# Altium schematic sheet Scan card MCU&Power.SchDoc: MCU & Power
size A3; DrawnBy: G Ivanov; Revision: 00; SheetNumber: 1; SheetTotal: 2; ProjectTitle: SCAN2000-20 STM32 Card; Variant: [No variants]; SheetSize: A3; SPICEModelCacheGEYJKKNZ: <root> / <DocumentId>GEYJKKNZ</DocumentId> / </root>
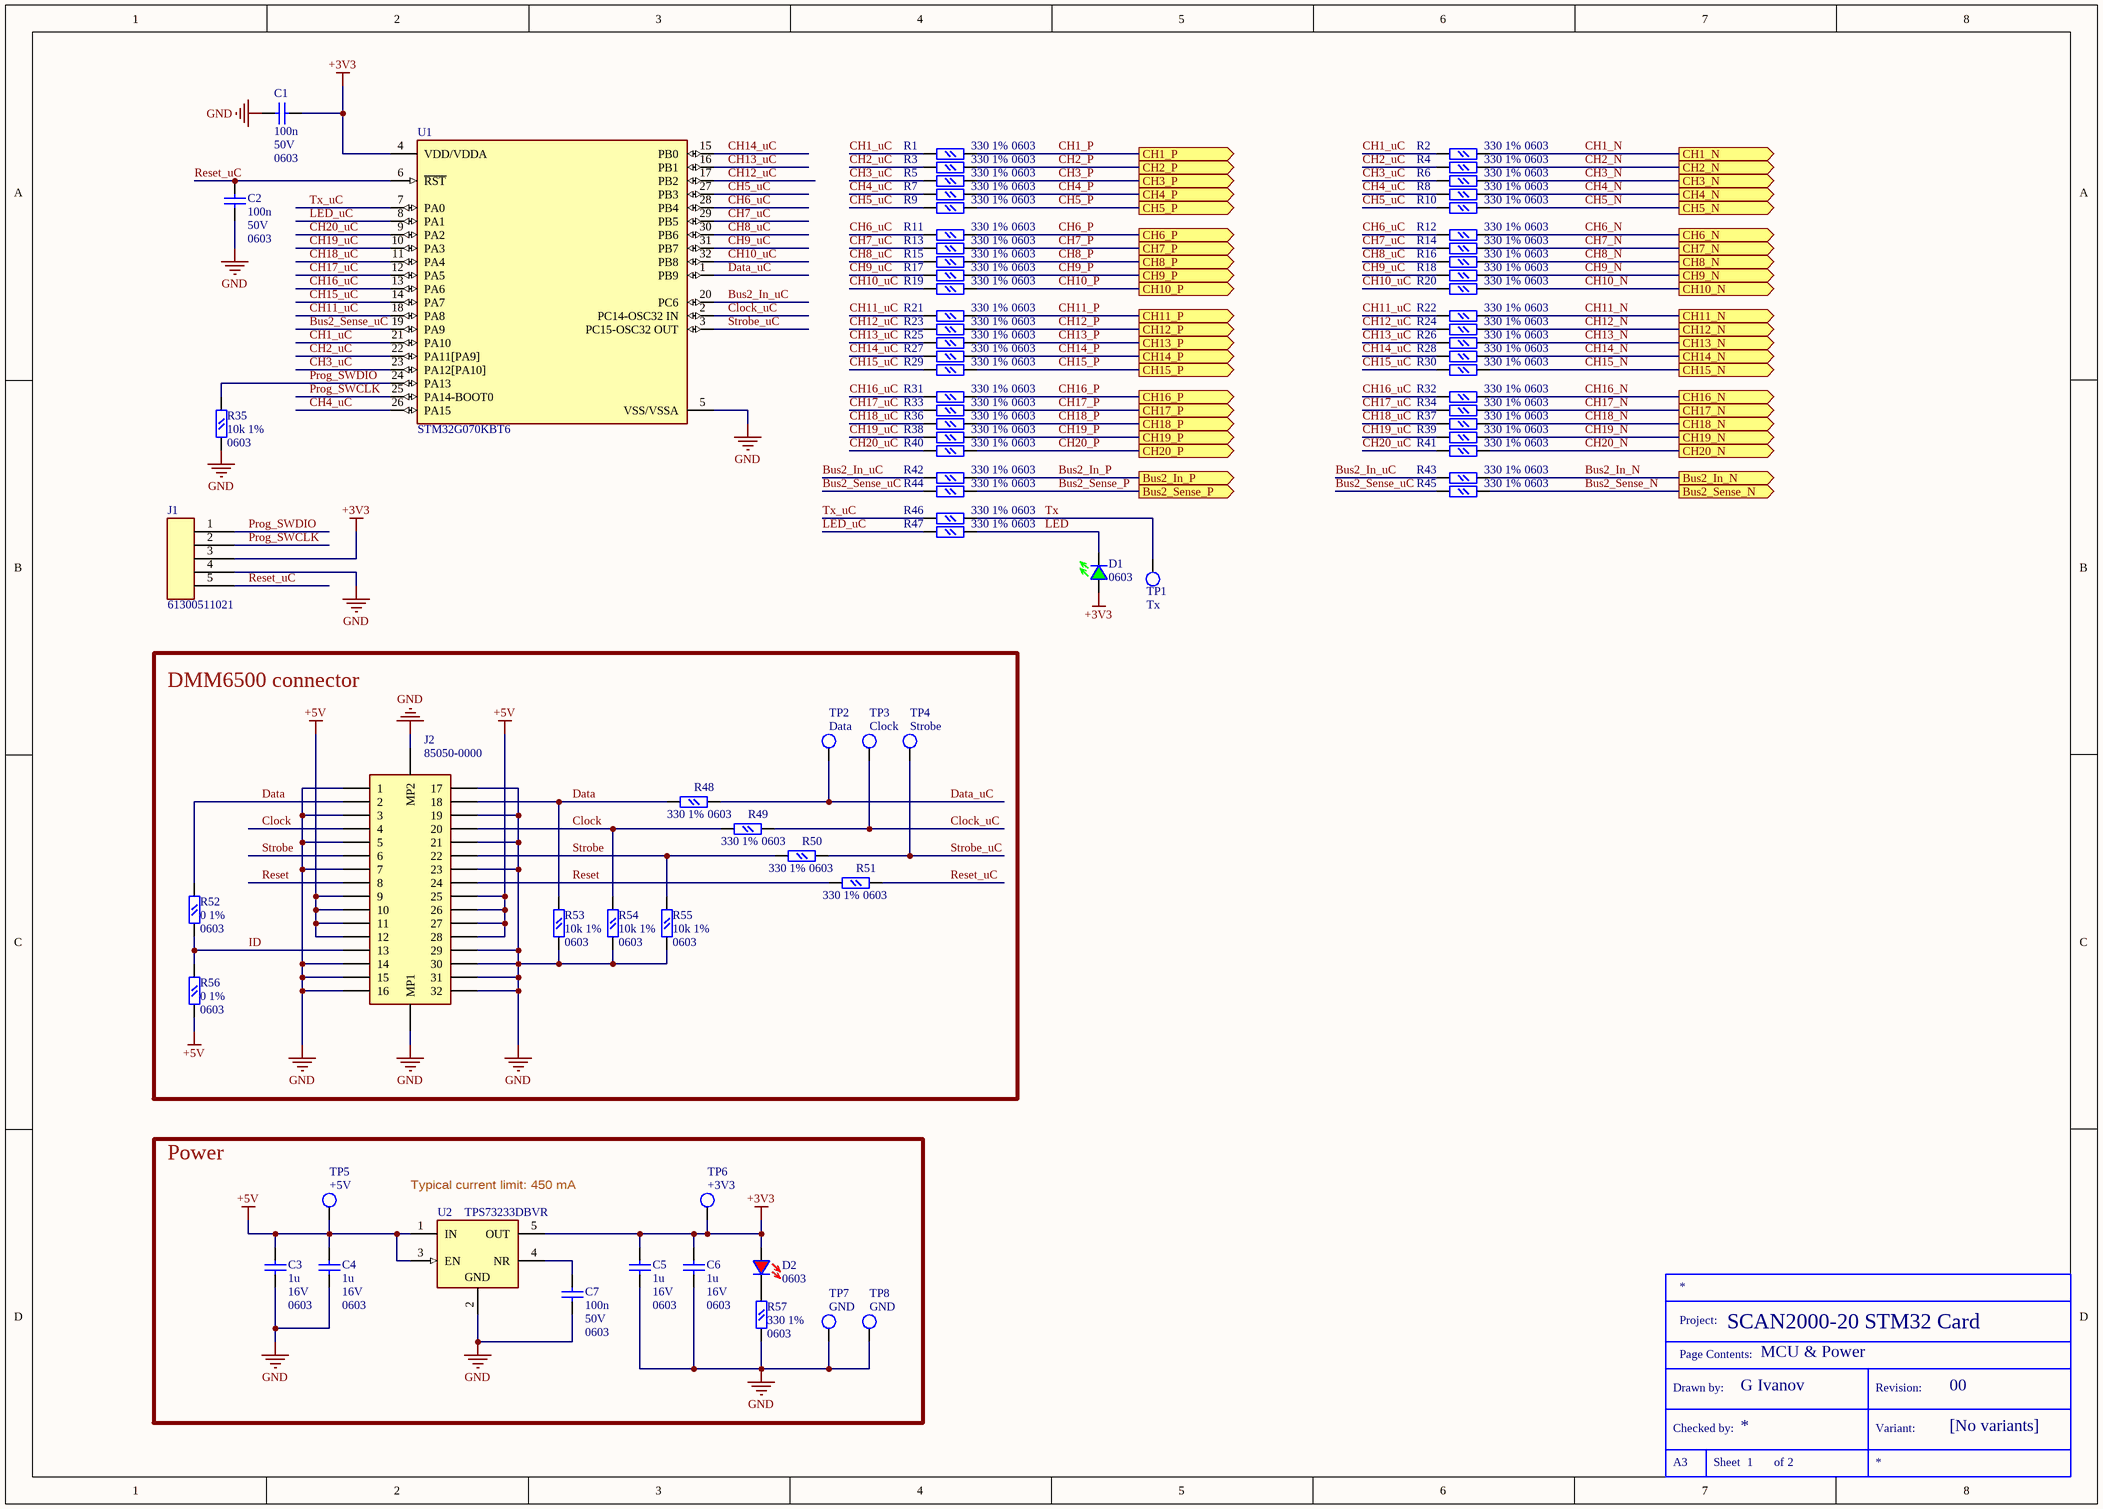
[diagram p0: Scan card MCU&Power.SchDoc]

## Parts
C1  100n  Voltage: 50V  Package (imperial): 0603  [CAPC1608X08N]
C2  100n  Voltage: 50V  Package (imperial): 0603  [CAPC1608X08N]
C3  1u  Voltage: 16V  Package (imperial): 0603  [CAPC1608X08N]
C4  1u  Voltage: 16V  Package (imperial): 0603  [CAPC1608X08N]
C5  1u  Voltage: 16V  Package (imperial): 0603  [CAPC1608X08N]
C6  1u  Voltage: 16V  Package (imperial): 0603  [CAPC1608X08N]
C7  100n  Voltage: 50V  Package (imperial): 0603  [CAPC1608X08N]
D1  0603  [LED0603green]
D2  0603  [LED0603red]
J1  61300511021  [WE 61300511021]
J2  85050-0000  [Molex 85050-0000]
R1  330 1%  Package (imperial): 0603  [RESC1608X06N]
R2  330 1%  Package (imperial): 0603  [RESC1608X06N]
R3  330 1%  Package (imperial): 0603  [RESC1608X06N]
R4  330 1%  Package (imperial): 0603  [RESC1608X06N]
R5  330 1%  Package (imperial): 0603  [RESC1608X06N]
R6  330 1%  Package (imperial): 0603  [RESC1608X06N]
R7  330 1%  Package (imperial): 0603  [RESC1608X06N]
R8  330 1%  Package (imperial): 0603  [RESC1608X06N]
R9  330 1%  Package (imperial): 0603  [RESC1608X06N]
R10  330 1%  Package (imperial): 0603  [RESC1608X06N]
R11  330 1%  Package (imperial): 0603  [RESC1608X06N]
R12  330 1%  Package (imperial): 0603  [RESC1608X06N]
R13  330 1%  Package (imperial): 0603  [RESC1608X06N]
R14  330 1%  Package (imperial): 0603  [RESC1608X06N]
R15  330 1%  Package (imperial): 0603  [RESC1608X06N]
R16  330 1%  Package (imperial): 0603  [RESC1608X06N]
R17  330 1%  Package (imperial): 0603  [RESC1608X06N]
R18  330 1%  Package (imperial): 0603  [RESC1608X06N]
R19  330 1%  Package (imperial): 0603  [RESC1608X06N]
R20  330 1%  Package (imperial): 0603  [RESC1608X06N]
R21  330 1%  Package (imperial): 0603  [RESC1608X06N]
R22  330 1%  Package (imperial): 0603  [RESC1608X06N]
R23  330 1%  Package (imperial): 0603  [RESC1608X06N]
R24  330 1%  Package (imperial): 0603  [RESC1608X06N]
R25  330 1%  Package (imperial): 0603  [RESC1608X06N]
R26  330 1%  Package (imperial): 0603  [RESC1608X06N]
R27  330 1%  Package (imperial): 0603  [RESC1608X06N]
R28  330 1%  Package (imperial): 0603  [RESC1608X06N]
R29  330 1%  Package (imperial): 0603  [RESC1608X06N]
R30  330 1%  Package (imperial): 0603  [RESC1608X06N]
R31  330 1%  Package (imperial): 0603  [RESC1608X06N]
R32  330 1%  Package (imperial): 0603  [RESC1608X06N]
R33  330 1%  Package (imperial): 0603  [RESC1608X06N]
R34  330 1%  Package (imperial): 0603  [RESC1608X06N]
R35  10k 1%  Package (imperial): 0603  [RESC1608X06N]
R36  330 1%  Package (imperial): 0603  [RESC1608X06N]
R37  330 1%  Package (imperial): 0603  [RESC1608X06N]
R38  330 1%  Package (imperial): 0603  [RESC1608X06N]
R39  330 1%  Package (imperial): 0603  [RESC1608X06N]
R40  330 1%  Package (imperial): 0603  [RESC1608X06N]
R41  330 1%  Package (imperial): 0603  [RESC1608X06N]
R42  330 1%  Package (imperial): 0603  [RESC1608X06N]
R43  330 1%  Package (imperial): 0603  [RESC1608X06N]
R44  330 1%  Package (imperial): 0603  [RESC1608X06N]
R45  330 1%  Package (imperial): 0603  [RESC1608X06N]
R46  330 1%  Package (imperial): 0603  [RESC1608X06N]
R47  330 1%  Package (imperial): 0603  [RESC1608X06N]
R48  330 1%  Package (imperial): 0603  [RESC1608X06N]
R49  330 1%  Package (imperial): 0603  [RESC1608X06N]
R50  330 1%  Package (imperial): 0603  [RESC1608X06N]
R51  330 1%  Package (imperial): 0603  [RESC1608X06N]
R52  0 1%  Package (imperial): 0603  [RESC1608X06N]
R53  10k 1%  Package (imperial): 0603  [RESC1608X06N]
R54  10k 1%  Package (imperial): 0603  [RESC1608X06N]
R55  10k 1%  Package (imperial): 0603  [RESC1608X06N]
R56  0 1%  Package (imperial): 0603  [RESC1608X06N]
R57  330 1%  Package (imperial): 0603  [RESC1608X06N]
TBLOCK?  *  (value not drawn)  (graphical)
TP1  Tx  [TP_ROUND_20_10]
TP2  Data  [TP_ROUND_20_10]
TP3  Clock  [TP_ROUND_20_10]
TP4  Strobe  [TP_ROUND_20_10]
TP5  +5V  [TP_ROUND_20_10]
TP6  +3V3  [TP_ROUND_20_10]
TP7  GND  [TP_ROUND_20_10]
TP8  GND  [TP_ROUND_20_10]
U1  STM32G070KBT6  [LQFP80P900X900X160-32N]
U2  TPS73233DBVR  [SOT23-5-095_N]

## Blocks framed on the sheet
DMM6500 connector: J2 R48-R56 TP2-TP4
Power: C3-C7 D2 R57 TP5-TP8 U2

## Ports
Bus2_In_N (out), Bus2_In_P (out), Bus2_Sense_N (out), Bus2_Sense_P (out), CH1_N (out), CH1_P (out), CH2_N (out), CH2_P (out), CH3_N (out), CH3_P (out), CH4_N (out), CH4_P (out), CH5_N (out), CH5_P (out), CH6_N (out), CH6_P (out), CH7_N (out), CH7_P (out), CH8_N (out), CH8_P (out), CH9_N (out), CH9_P (out), CH10_N (out), CH10_P (out), CH11_N (out), CH11_P (out), CH12_N (out), CH12_P (out), CH13_N (out), CH13_P (out), CH14_N (out), CH14_P (out), CH15_N (out), CH15_P (out), CH16_N (out), CH16_P (out), CH17_N (out), CH17_P (out), CH18_N (out), CH18_P (out), CH19_N (out), CH19_P (out), CH20_N (out), CH20_P (out)

## Nets
+3V3: C1.1 C5.2 C6.2 D1.2(Anode) D2.2(Anode) J1.3 TP6.1 U1.4(VDD/VDDA) U2.5(OUT)
+5V: C3.2 C4.2 J2.A9(9) J2.A10(10) J2.A11(11) J2.A12(12) J2.B9(25) J2.B10(26) J2.B11(27) J2.B12(28) R56.1 TP5.1 U2.1(IN) U2.3(EN)
GND: C1.2 C2.1 C3.1 C4.1 C5.1 C6.1 C7.1 J1.4 J2.A1(1) J2.A3(3) J2.A5(5) J2.A7(7) J2.A14(14) J2.A15(15) J2.A16(16) J2.B1(17) J2.B3(19) J2.B5(21) J2.B7(23) J2.B13(29) J2.B14(30) J2.B15(31) J2.B16(32) J2.MP1 J2.MP2 R35.1 R53.1 R54.1 R55.1 R57.1 TP7.1 TP8.1 U1.5(VSS/VSSA) U2.2(GND)
Bus2_In_N: R43.2 ; port Bus2_In_N
Bus2_In_P: R42.2 ; port Bus2_In_P
Bus2_In_uC: R42.1 R43.1 U1.20(PC6)
Bus2_Sense_N: R45.2 ; port Bus2_Sense_N
Bus2_Sense_P: R44.2 ; port Bus2_Sense_P
Bus2_Sense_uC: R44.1 R45.1 U1.19(PA9)
CH1_N: R2.2 ; port CH1_N
CH1_P: R1.2 ; port CH1_P
CH1_uC: R1.1 R2.1 U1.21(PA10)
CH2_N: R4.2 ; port CH2_N
CH2_P: R3.2 ; port CH2_P
CH2_uC: R3.1 R4.1 U1.22(PA11[PA9])
CH3_N: R6.2 ; port CH3_N
CH3_P: R5.2 ; port CH3_P
CH3_uC: R5.1 R6.1 U1.23(PA12[PA10])
CH4_N: R8.2 ; port CH4_N
CH4_P: R7.2 ; port CH4_P
CH4_uC: R7.1 R8.1 U1.26(PA15)
CH5_N: R10.2 ; port CH5_N
CH5_P: R9.2 ; port CH5_P
CH5_uC: R9.1 R10.1 U1.27(PB3)
CH6_N: R12.2 ; port CH6_N
CH6_P: R11.2 ; port CH6_P
CH6_uC: R11.1 R12.1 U1.28(PB4)
CH7_N: R14.2 ; port CH7_N
CH7_P: R13.2 ; port CH7_P
CH7_uC: R13.1 R14.1 U1.29(PB5)
CH8_N: R16.2 ; port CH8_N
CH8_P: R15.2 ; port CH8_P
CH8_uC: R15.1 R16.1 U1.30(PB6)
CH9_N: R18.2 ; port CH9_N
CH9_P: R17.2 ; port CH9_P
CH9_uC: R17.1 R18.1 U1.31(PB7)
CH10_N: R20.2 ; port CH10_N
CH10_P: R19.2 ; port CH10_P
CH10_uC: R19.1 R20.1 U1.32(PB8)
CH11_N: R22.2 ; port CH11_N
CH11_P: R21.2 ; port CH11_P
CH11_uC: R21.1 R22.1 U1.18(PA8)
CH12_N: R24.2 ; port CH12_N
CH12_P: R23.2 ; port CH12_P
CH12_uC: R23.1 R24.1 U1.17(PB2)
CH13_N: R26.2 ; port CH13_N
CH13_P: R25.2 ; port CH13_P
CH13_uC: R25.1 R26.1 U1.16(PB1)
CH14_N: R28.2 ; port CH14_N
CH14_P: R27.2 ; port CH14_P
CH14_uC: R27.1 R28.1 U1.15(PB0)
CH15_N: R30.2 ; port CH15_N
CH15_P: R29.2 ; port CH15_P
CH15_uC: R29.1 R30.1 U1.14(PA7)
CH16_N: R32.2 ; port CH16_N
CH16_P: R31.2 ; port CH16_P
CH16_uC: R31.1 R32.1 U1.13(PA6)
CH17_N: R34.2 ; port CH17_N
CH17_P: R33.2 ; port CH17_P
CH17_uC: R33.1 R34.1 U1.12(PA5)
CH18_N: R37.2 ; port CH18_N
CH18_P: R36.2 ; port CH18_P
CH18_uC: R36.1 R37.1 U1.11(PA4)
CH19_N: R39.2 ; port CH19_N
CH19_P: R38.2 ; port CH19_P
CH19_uC: R38.1 R39.1 U1.10(PA3)
CH20_N: R41.2 ; port CH20_N
CH20_P: R40.2 ; port CH20_P
CH20_uC: R40.1 R41.1 U1.9(PA2)
Clock: J2.A4(4) J2.B4(20) R49.1 R54.2
Clock_uC: R49.2 TP3.1 U1.2(PC14-OSC32_IN)
Data: J2.A2(2) J2.B2(18) R48.1 R52.2 R53.2
Data_uC: R48.2 TP2.1 U1.1(PB9)
ID: J2.A13(13) R52.1 R56.2
LED: D1.1(Cathode) R47.2
LED_uC: R47.1 U1.8(PA1)
Prog_SWCLK: J1.2 U1.25(PA14-BOOT0)
Prog_SWDIO: J1.1 R35.2 U1.24(PA13)
Reset: J2.A8(8) J2.B8(24) R51.1
Reset_uC: C2.2 J1.5 R51.2 U1.6(~{RST})
Strobe: J2.A6(6) J2.B6(22) R50.1 R55.2
Strobe_uC: R50.2 TP4.1 U1.3(PC15-OSC32_OUT)
Tx: R46.2 TP1.1
Tx_uC: R46.1 U1.7(PA0)
NetC7_2: C7.2 U2.4(NR)
NetD2_1: D2.1(Cathode) R57.2

## Notes on the sheet
- (near U2) Typical current limit: 450 mA
- (in symbol TitleBlockStandard) Project:; Page Contents:; Drawn by:; Revision:; Checked by:; Variant:; Sheet; of

## Library data of the parts
C1 C2 C7 = CC0603KRX7R9BB104: Multilayer Ceramic Capacitor, CC Series, 0.1 - F, - 10%, X7R, 50 V, 0603 [1608 Metric]; Manufacturer: Yageo; Accuracy: 0.1; Package (metric): 1608; Part Number: CC0603KRX7R9BB104; Height: 0.8mm; Capacitance: 100n; Material: X7R; Pin Count: 2; ComponentLink1Description: Datasheet; ComponentLink1URL: Datasheets\Capacitors\Yageo X7R.pdf
C3-C6 = CC0603KRX7R7BB105: 0603 1 uF 16 V ±10 % Tolerance X7R SMT Multilayer Ceramic Capacitor; Manufacturer: Yageo; Accuracy: 0.1; Package (metric): 1608; Part Number: CC0603KRX7R7BB105; Height: 0.8mm; Capacitance: 1u; Material: X7R; Pin Count: 3; ComponentLink1Description: Datasheet; ComponentLink1URL: Datasheets\Capacitors\Yageo X7R.pdf
D1 = LED0603green: Generic LED green 0603; Package (metric): 1608; Part Number: LED0603green; Color: green; Package (imperial): 0603
D2 = LED0603red: Generic LED red 0603; Package (metric): 1608; Part Number: LED0603red; Color: red; Package (imperial): 0603
J1 = 61300511021: single row, 5p; Manufacturer: Wurth Elektronik; Desctiption: Pin Header, pitch 2.54 mm, THT, Angled, single row, 5p; Part Number: 61300511021; Pin Count: 5; ComponentLink1Description: Datasheet; ComponentLink1URL: https://www.we-online.com/catalog/en/PHD_2_54_THT_ANGLED_PIN_HEADER_6130XX11021; ComponentLink2Description: Drawing; ComponentLink2URL: Datasheets\Connectors\WE\61300511021_drawing.pdf
J2 = 85050-0000: 32 pos. female connector DIN41612 style Q/2 + clip; Manufacturer: Molex; Desctiption: 2.54mm Pitch DIN 41612 Receptacle, Style Q/2 Reverse, 32 Circuits; Part Number: 85050-0000; Pin Count: 32; ComponentLink1Description: Datasheet; ComponentLink1URL: Datasheets\Connectors\Molex\850500000_datasheet.pdf; ComponentLink2Description: Drawing; ComponentLink2URL: Datasheets\Connectors\Molex\850500000_drawing.pdf; ComponentLink3Description: 3D Model; ComponentLink3URL: 3D Models\Connectors\Molex\850500000.stp
R1-R34 R36-R51 R57 = RC0603FR-07330RL: YAGEO (PHYCOMP) - RC0603FR-07330RL - RES, THICK FILM, 330R, 1%, 0.1W, 0603; Resistance: 330; Power: 100mW; Package (metric): 1608; Part Number: RC0603FR-07330RL; Manufacturer: Yageo; Height: 0.45mm; Accuracy: 1%; Pin Count: 2; ComponentLink1Description: Datasheet; ComponentLink1URL: Datasheets\Resistors\Yageo 0603.pdf
R35 R53-R55 = RC0603FR-0710KL: 100mW 75V ±100ppm/℃ ±1% -55℃~+155℃ 10kΩ 0603 Chip Resistor - Surface Mount ROHS; Manufacturer: Yageo; Package (metric): 1608; Part Number: RC0603FR-0710KL; Height: 0.45mm; Resistance: 10k; Power: 100mW; Accuracy: 1%; Pin Count: 2; ComponentLink1Description: Datasheet; ComponentLink1URL: Datasheets\Resistors\Yageo 0603.pdf
R52 R56 = RC0603FR-070RL: RC Series 0603 0.1 W 0 Ohm Jumper Surface Mount Thick Film Chip Resistor; Manufacturer: Yageo; Resistance: 0; Power: 100mW; Package (metric): 1608; Part Number: RC0603FR-070RL; Height: 0.45mm; Accuracy: 1%; Pin Count: 3; ComponentLink1Description: Datasheet; ComponentLink1URL: Datasheets\Resistors\Yageo 0603.pdf
TBLOCK? = TitleBlockStandard: Designator: TBLOCK?; Part Number: TitleBlockStandard
TP1-TP8 = TP_ROUND_20_10: Test point, round pad, 1 mm hole, 2 mm dia; Part Number: TP_ROUND_20_10
U1 = STM32G070KBT6: Arm® Cortex®-M0+ 32-bit MCU, 128 KB Flash, 36 KB RAM,  4x USART, timers, ADC, comm. I/Fs, 2.0-3.6V; Manufacturer: STM; Number Of Timers/Counters: 11; Ram Size: 36KBytes; Memory Size: 128KBytes; Number Of Cores: 1; Core Architecture: ARM Cortex-M0+; Number Of Spi Channels: 2; Data Bus Width: 32bits; Max Supply Voltage: 3.6V; Standoff Height: 0.05mm; Max Junction Temp: +105°C; Nominal Supply Current: 0.3-6.9mA; Frequency: 64MHz; Number Of Adc Channels: 13; Number Of I/Os: 29; Min Supply Voltage: 2V; Interface: I2C,SPI,UART,USART,LIN,IrDA,I2S,SMBus,Other; Number Of Uart Channels: 4; Operating Frequency(F) (Processor speed) (MHz): 64; FLASH Size (Prog) (kB): 128; Internal RAM Size (kB): 36; Memory Type: FLASH; Ambient Temperature Range High: +85°C; Automotive: No; Octopart: https://octopart.com/stm32g070kbt6-stmicroelectronics-97300430; Temperature: -40°C to +85°C; Temperature Range Low: -40°C; Package: LQFP32-5V; Manufacturer Part Number: STM32G070KBT6; Number Of I2C Channels: 2; Height: 1.6mm; Device Class L3: Microcontrollers; ComponentLink2URL: https://www.st.com/resource/en/reference_manual/rm0454-stm32g0x0-advanced-armbased-32bit-mcus-stmicroelectronics.pdf; Device Class L2: Embedded Processors and Controllers; ComponentLink2Description: Datasheet; Number Of A/D Converters: 1; Temperature Range High: +85°C; Ambient Temperature Range Low: -40°C; Category: IC; Lead Free: Yes; Ipc Land Pattern Name: QFP80P900X900X160-32; Mouser Description: Cortex M0 128K LQFP32 85°C; RoHS: TRUE; Device Class L1: Integrated Circuits (ICs); Digikey Description: MAINSTREAM VALUE LINE, ARM CORTE; Part Number: STM32G070KBT6; ComponentLink1Description: Package Specification; ComponentLink1URL: https://www.st.com/resource/en/datasheet/stm32g070kb.pdf; ComponentLink3Description: Manufacturer URL; ComponentLink3URL: https://www.st.com/en/microcontrollers-microprocessors/stm32g070kb.html#documentation; PackageDescription: 32-Pin Low Profile Quad Flat Package, 7 x 7 mm Body, 0.8 mm Pitch; PackageReference: LQFP32; Supply Voltage(Vcc) min (V): 2; Mounting Technology: Surface Mount; I/Os (High Current): 29; Core: ARM Cortex-M0+
U2 = TPS73233DBVR: Single Output Fast Transient Response LDO, 200 mA, Fixed 3.3 V Output, 1.7 to 5.5 V Input, with Reverse Current Protection, 5-pin SOT-23 (DBV), -40 to 85 degC, Green (RoHS & no Sb/Br); Manufacturer: Texas Instruments; Vin(Max)(V): 5.5; Vin(Min)(V): 1.7; Vout Adj(Min)(V): 3.3; Accuracy(%): 1; Iout(Max)(A): 0.25; SubFamily: Single Channel LDO; Iq(Typ)(mA): 0.4; Vdo(Typ)(mV): 40; ComponentLink2Description: Datasheet; DatasheetVersion: SBVS037O; PartNumber: TPS73233DBVR; ComponentLink1Description: Datasheet; PackageVersion: 4073253-4/K; Code_JEDEC: MO-178; ComponentLink1URL: Datasheets\LDO Regulators\tps732.pdf; ComponentLink3Description: Package Specification; Eco-Plan: Green (RoHS & no Sb/Br); PackageDescription: 5-Pin Plastic Small Outline, Body 1.60 Ãƒâ€” 2.90 mm, Pitch 0.95 mm; Fixed Output Options(V): 3.3; ComponentLink3URL: http://www.ti.com/litv/pdf/mpds018i; Vout Adj(Max)(V): 3.3; ComponentLink2URL: http://www.ti.com/general/docs/lit/getliterature.tsp?genericPartNumber=TPS73233&fileType=pdf; PackageReference: DBV0005A; Mounting Technology: Surface Mount; Part Number: TPS73233DBVR; Pin Count: 5